# Altium schematic sheet En_V2.SchDoc
size A3
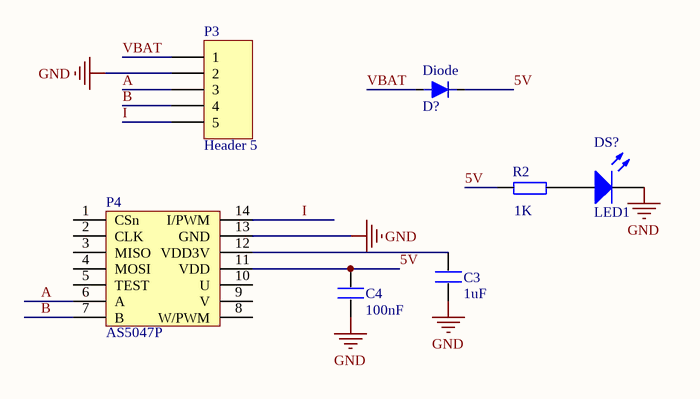
[diagram p0: En_V2.SchDoc]

## Parts
C3  1uF  [0603P]
C4  100nF  [0603P]
Diode  D?  [LC-SOD-123F]
DS?  LED1  [0603_LED]
P3  Header 5  [MX2.54-5P直针]
P4  AS5047P  [TSSOP-14]
R2  1K  [0603P]

## Nets
GND: C3.1 C4.1 DS?.2(K) P3.2 P4.13(GND)
5V: C4.2 Diode.2 P4.11(VDD) R2.1
A: P3.3 P4.6(A)
B: P3.4 P4.7(B)
I: P3.5 P4.14(I/PWM)
VBAT: Diode.1 P3.1
NetC3_2: C3.2 P4.12(VDD3V)
NetDS?_1: DS?.1(A) R2.2

Not connected (* = marked no-connect by the designer): P4 1(CSn) 2(CLK) 3(MISO) 4(MOSI) 5(TEST) 8(W/PWM) 9(V) 10(U)

## Library data of the parts
C3 C4 = C
Diode = 肖特基
DS? = LED2: Typical RED, GREEN, YELLOW, AMBER GaAs LED; Published: 8-Jun-2000; LatestRevisionDate: 17-Jul-2002; LatestRevisionNote: Re-released for DXP Platform.; PackageDocument: Feb-2002; PackageReference: 3.2X1.6X1.1; Publisher: Altium Limited
P3 = Header 5: Header, 5-Pin; LatestRevisionDate: 17-Jul-2002; LatestRevisionNote: Re-released for DXP Platform.; Publisher: Altium Limited
P4 = AS5047P-TSSOP14
R2 = R